# Altium schematic sheet Serial ID EEPROM.SchDoc: I2C Serial ID EEprom
size A4; DocumentNumber: 52; SheetNumber: 52; SheetTotal: 54
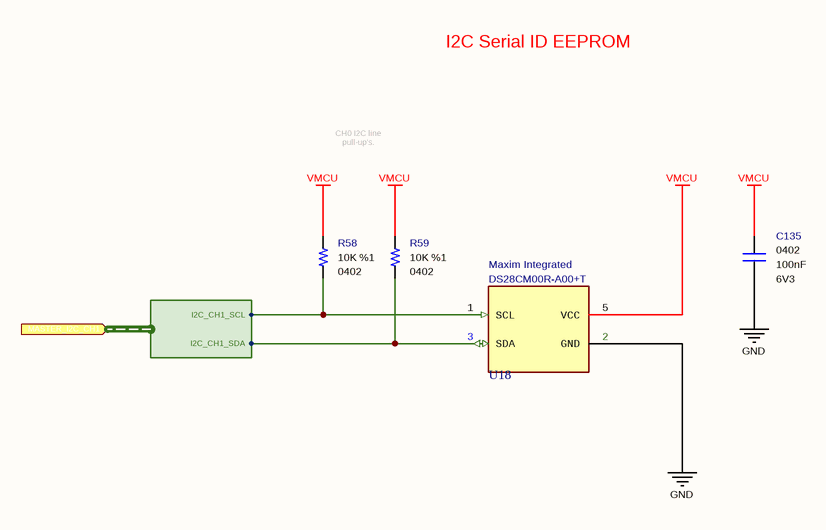
[diagram p0: Serial ID EEPROM.SchDoc]

## Parts
C135  value 100nF  Case: 0402  Voltage: 6V3  [CAPACITOR_0402]  (hidden comment: Multilayer Ceramic Capacitor)
R58  value 10K  Tolerance: %1  Case: 0402  [RESISTOR_0402]  (hidden comment: Thick Film Resistor)
R59  value 10K  Tolerance: %1  Case: 0402  [RESISTOR_0402]  (hidden comment: Thick Film Resistor)
U18  Manufacturer Part Number: DS28CM00R-A00+T  Manufacturer Name: Maxim Integrated  [SOT-23-5]  (hidden comment: Security ICs / Authentication ICs)

## Ports
MASTER_I2C_CH1 (in, harness MASTER_I2C_CH1)

## Harnesses
MASTER_I2C_CH1: I2C_CH1_SDA, I2C_CH1_SCL

## Nets
GND: C135.1 U18.2(GND)
VMCU: C135.2 R58.2 R59.2 U18.5(VCC)
NetR58_1: R58.1 U18.1(SCL) ; port MASTER_I2C_CH1.I2C_CH1_SCL
NetR59_1: R59.1 U18.3(SDA) ; port MASTER_I2C_CH1.I2C_CH1_SDA

Not connected (* = marked no-connect by the designer): U18 4(NC)

## Notes on the sheet
- I2C Serial ID EEPROM
- CH0 I2C line pull-up's.
- Engineer
- All Rights are reserved to Customer and Engineer. [2021]
- Size:
- Date:
- A4
- Project :
- Time:
- Sheet
- of
- Customer
- Product ID
- Module ID
- Version
- File:
- Revision

## Library data of the parts
C135 = Capacitor - 100nF [0402-6V3]: Capacitor - 100nF [0402-6V3] (Ceramic); Manufacturer Name: AVX; Manufacturer Part Number: 04026D104KAT4A; Dielectric: X5R; Tolerance: %10; Height: 0.25mm; ComponentLink1Description: Mouser; ComponentLink1URL: https://www.mouser.com.tr/ProductDetail/AVX/04026D104KAT4A?qs=sGAEpiMZZMs0AnBnWHyRQPg4iYkCw7IMED%2F4kpqgf7w%3D; ComponentLink2Description: DataSheet; ComponentLink2URL: https://www.mouser.com.tr/datasheet/2/40/cx5r-776519.pdf; ROHS: Yes; Maximum Operating Temperature: +85; Minimum Operating Temperature: -55; Supplier 1: Avnet; Supplier Part Number 1: 04026D104KAT4A; Mouser Part Number: 581-04026D104KAT4A
R58 R59 = Resistor - 10K: Thick Film Resistors - SMD 1/16 W 10 Kohms 1%; Manufacturer Name: Vishay; Manufacturer Part Number: CRCW040210K0FKED; Height: 0.4mm; ComponentLink1Description: DataSheet; ComponentLink1URL: https://www.mouser.com.tr/datasheet/2/427/dcrcwe3-1762152.pdf; ComponentLink2Description: Mouser; ComponentLink2URL: https://www.mouser.com.tr/ProductDetail/Vishay-Dale/CRCW040210K0FKED?qs=sGAEpiMZZMu61qfTUdNhG2DpbjADlD3GcalbOv9utCY%3D; Supplier 1: Mouser; Supplier 2: Digi-Key; Supplier Part Number 1: 71-CRCW040210K0FKEDH; Supplier Part Number 2: 541-10.0KYCT-ND; Mouser Part Number: 71-CRCW0402-10K-E3
U18 = IC - DS28CM00R-A00+T: Security ICs / Authentication ICs I C/SMBus Silicon Serial Number; Case: SOT-23-5; RoHS: Yes; ComponentLink1Description: DataSheet; ComponentLink1URL: https://www.mouser.com.tr/datasheet/2/256/DS28CM00-1514106.pdf; ComponentLink2Description: Mouser; ComponentLink2URL: https://www.mouser.com.tr/ProductDetail/Maxim-Integrated/DS28CM00R-A00%2bT/?qs=0Y9aZN%252BMVCUcpogu0Fss%2Fg%3D%3D; Supplier 1: RSComponents; Supplier 2: Mouser; Supplier 3: Future Electronics; Supplier 4: Farnell; Supplier 5: Newark; Supplier 6: Digi-Key; Supplier 7: Digi-Key; Supplier 8: Digi-Key; Supplier Part Number 1: 1904836; Supplier Part Number 2: 700-DS28CM00R-A00T; Supplier Part Number 4: 2514574; Supplier Part Number 5: 73Y1608; Supplier Part Number 6: DS28CM00R-A00+TCT-ND; Supplier Part Number 7: DS28CM00R-A00+TDKR-ND; Supplier Part Number 8: DS28CM00R-A00+TTR-ND; Supplier Part Number 3: 5092122; Mouser Part Number: 700-DS28CM00R-A00T